# Altium schematic sheet digital.SchDoc
size A
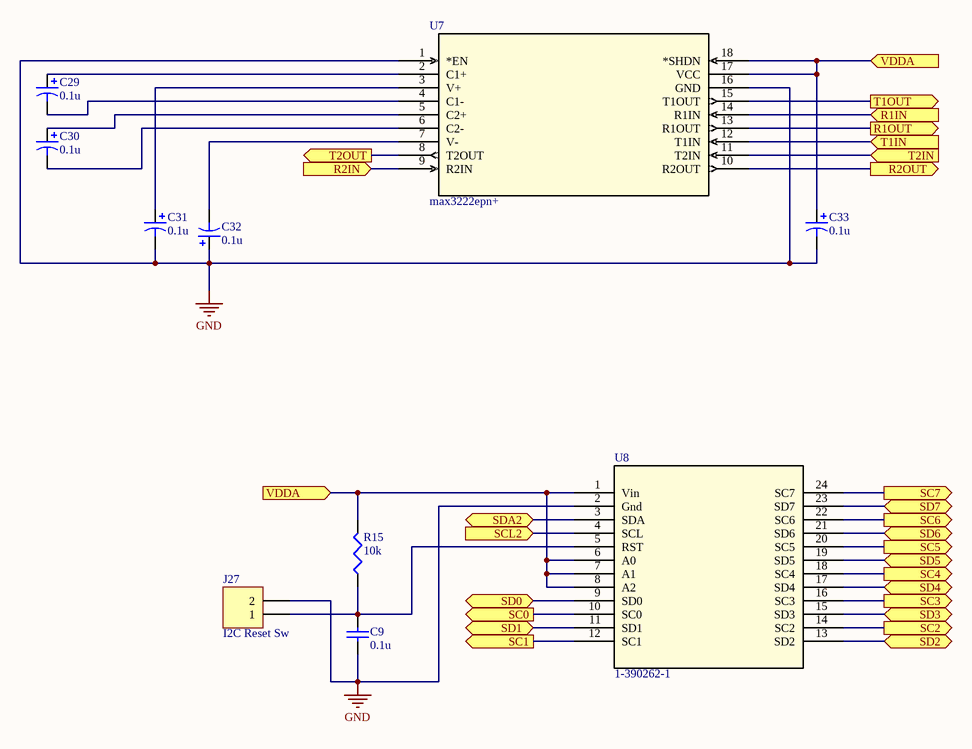
[diagram p0: digital.SchDoc]

## Parts
C9  0.1u  [C1206]
C29  0.1u  [C0805]
C30  0.1u  [C0805]
C31  0.1u  [C0805]
C32  0.1u  [C0805]
C33  0.1u  [C0805]
J27  I2C Reset Sw  [HDR1X2]
R15  10k  [J1-0603]
U7  max3222epn+  [21-0043D_18_MXM]
U8  1-390262-1  [1-390262-1_TYC]

## Ports
R1IN (in), R1OUT (out), R2IN (in), R2OUT (out), SC0 (out), SC1 (out), SC2 (out), SC3 (out), SC4 (out), SC5 (out), SC6 (out), SC7 (out), SCL2 (in), SD0 (bidir), SD1 (bidir), SD2 (bidir), SD3 (bidir), SD4 (bidir), SD5 (bidir), SD6 (bidir), SD7 (bidir), SDA2 (bidir), T1IN (in), T1OUT (out), T2IN (in), T2OUT (out), VDDA (in)

## Nets
GND: C9.1 C31.2 C32.1 C33.2 J27.2 U7.1(*EN) U7.16(GND) U8.2(Gnd)
R1IN: U7.14(R1IN) ; port R1IN
R1OUT: U7.13(R1OUT) ; port R1OUT
R2IN: U7.9(R2IN) ; port R2IN
R2OUT: U7.10(R2OUT) ; port R2OUT
SC0: U8.10(SC0) ; port SC0
SC1: U8.12(SC1) ; port SC1
SC2: U8.14(SC2) ; port SC2
SC3: U8.16(SC3) ; port SC3
SC4: U8.18(SC4) ; port SC4
SC5: U8.20(SC5) ; port SC5
SC6: U8.22(SC6) ; port SC6
SC7: U8.24(SC7) ; port SC7
SCL2: U8.4(SCL) ; port SCL2
SD0: U8.9(SD0) ; port SD0
SD1: U8.11(SD1) ; port SD1
SD2: U8.13(SD2) ; port SD2
SD3: U8.15(SD3) ; port SD3
SD4: U8.17(SD4) ; port SD4
SD5: U8.19(SD5) ; port SD5
SD6: U8.21(SD6) ; port SD6
SD7: U8.23(SD7) ; port SD7
SDA2: U8.3(SDA) ; port SDA2
T1IN: U7.12(T1IN) ; port T1IN
T1OUT: U7.15(T1OUT) ; port T1OUT
T2IN: U7.11(T2IN) ; port T2IN
T2OUT: U7.8(T2OUT) ; port T2OUT
VDDA: C33.1 R15.2 U7.17(VCC) U7.18(*SHDN) U8.1(Vin) U8.6(A0) U8.7(A1) U8.8(A2) ; port VDDA
NetC9_2: C9.2 J27.1 R15.1 U8.5(RST)
NetC29_1: C29.1 U7.2(C1+)
NetC29_2: C29.2 U7.4(C1-)
NetC30_1: C30.1 U7.5(C2+)
NetC30_2: C30.2 U7.6(C2-)
NetC31_1: C31.1 U7.3(V+)
NetC32_2: C32.2 U7.7(V-)

## Library data of the parts
C9 = Cap Semi: Capacitor (Semiconductor SIM Model); Value: 100pF; Published: 8-Jun-2000; LatestRevisionDate: 29-May-2009; LatestRevisionNote: IPC-7351 Footprint Added.; PackageReference: C1206; Publisher: Altium Limited; PackageDescription: Chip Capacitor
C29-C33 = Cap Pol3: Polarized Capacitor (Surface Mount); Value: 100pF; Published: 8-Jun-2000; LatestRevisionDate: 29-May-2009; LatestRevisionNote: IPC-7351 Footprint Added.; PackageReference: C0805; Publisher: Altium Limited; PackageDescription: Chip Capacitor
J27 = Header 2: LatestRevisionDate: 17-Jul-2002; LatestRevisionNote: Re-released for DXP Platform.; Publisher: Altium Limited
R15 = Res3: Resistor; Value: 1K; Published: 8-Jun-2000; LatestRevisionDate: 29-May-2009; LatestRevisionNote: IPC-7351 Footprint Added.; PackageReference: J1-0603; Publisher: Altium Limited; PackageDescription: Chip Resistor
U7 = max3222epn+: No Description Available; Mfr_Name: Maxim Integrated Products; Copyright: Copyright (C) 2022 Ultra Librarian. All rights reserved.; Manufacturer_Part_Number: max3222epn+; Digi-Key_Part_Number_1: MAX3222EPN+-ND; RefDes: RefDes; Type: DEV
U8 = 1-390262-1: No Description Available; Mfr_Name: TE Connectivity; Copyright: Copyright (C) 2022 Ultra Librarian. All rights reserved.; Manufacturer_Part_Number: 1-390262-1; RefDes: RefDes; Type: DEV